# EAGLE design AutoTunerV1 (EAGLE 9.6.2)

## Sheet 1 of 4: mcu
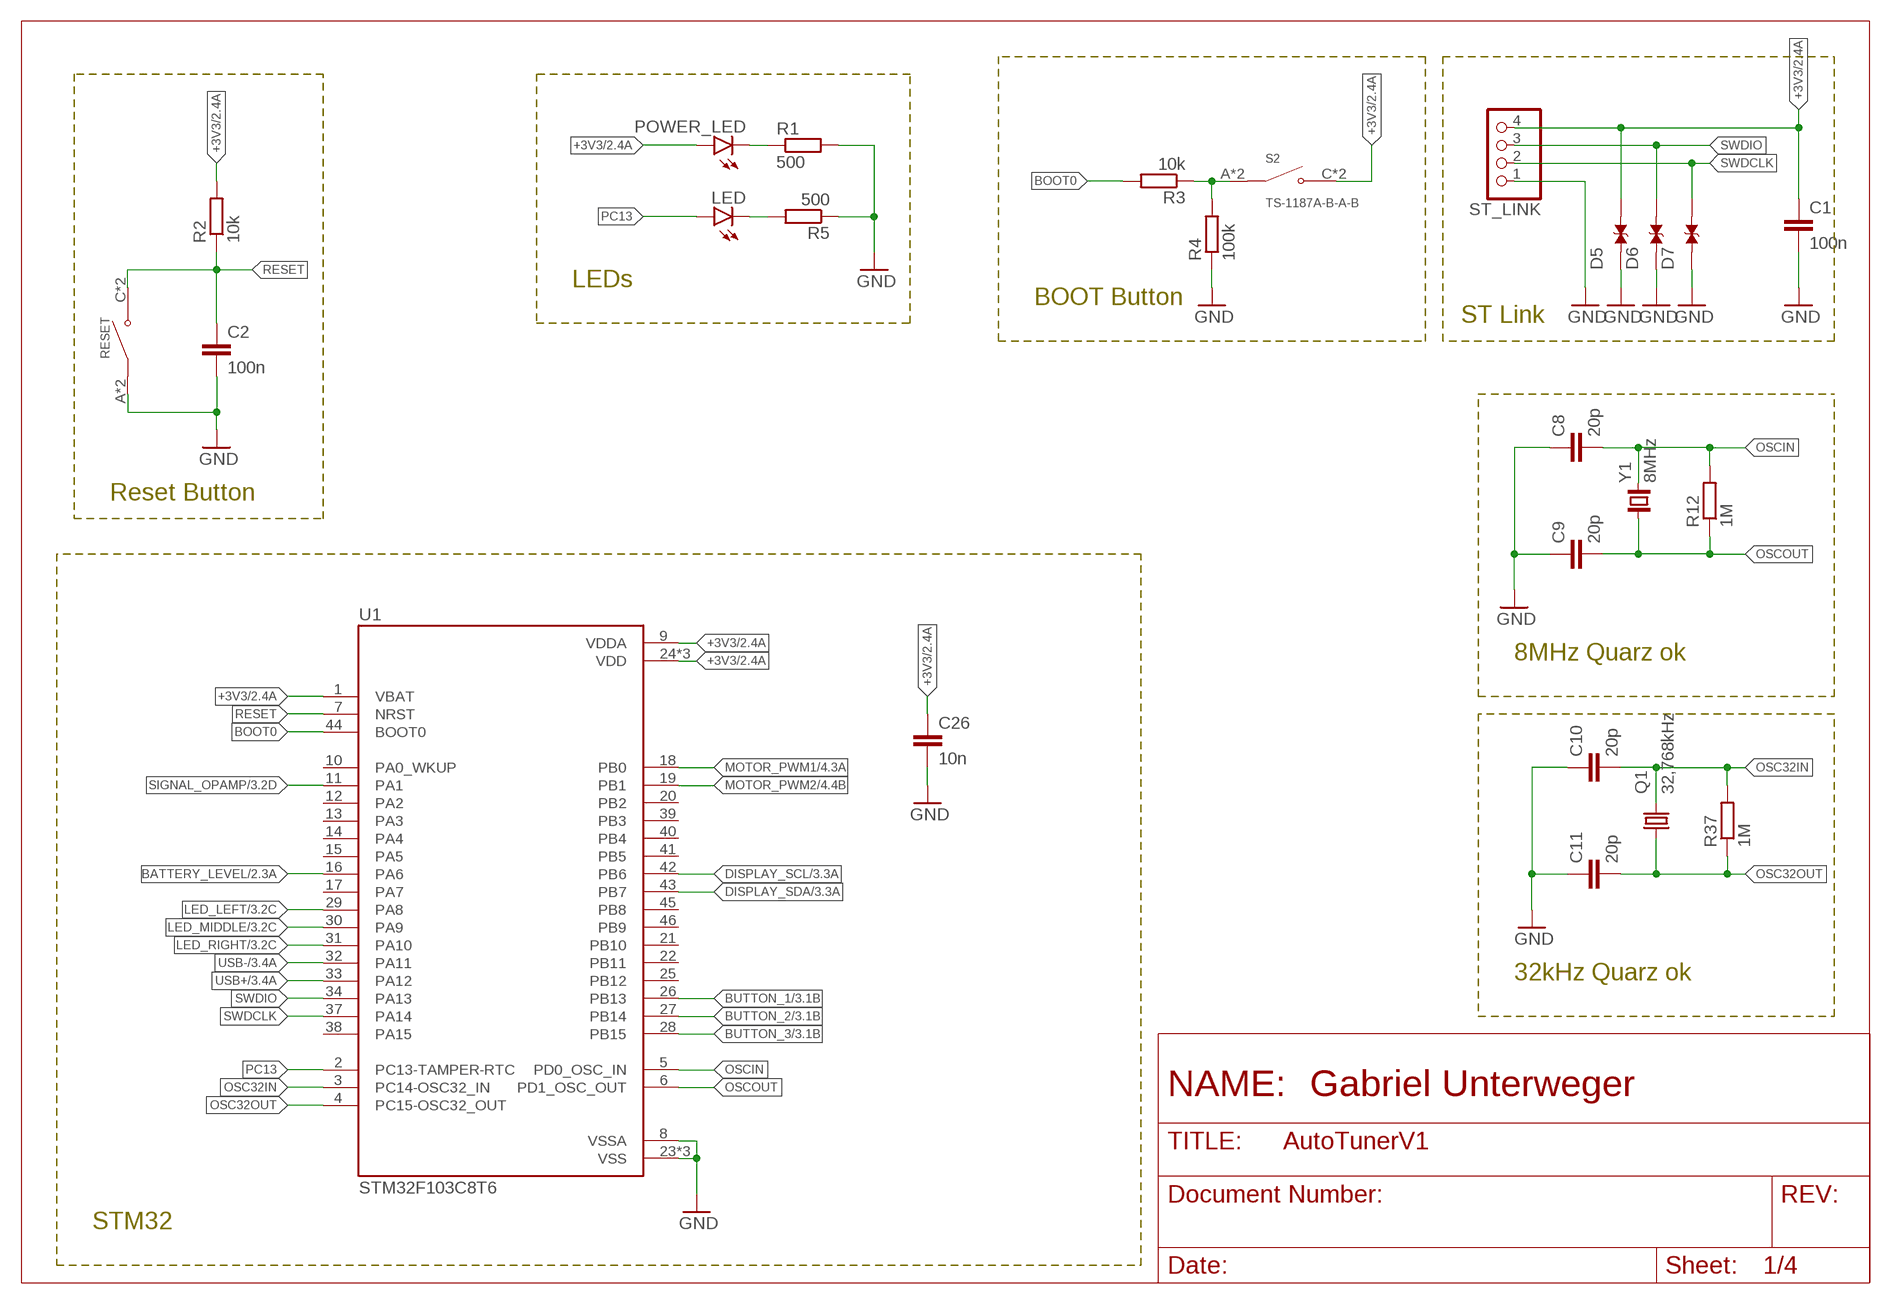
[diagram p0: schematic, sheet 1]

### Parts
C1  100n  C-EUC0805  [C0805]
C2  100n  C-EUC0805  [C0805]
C8  20p  C-EUC0805  [C0805]
C9  20p  C-EUC0805  [C0805]
C10  20p  C-EUC0805  [C0805]
C11  20p  C-EUC0805  [C0805]
C26  10n  C-EUC0805  [C0805]
D5  TESD5V0L1UC_RJG  [DIO_TESD5V0L1UC_RJG]
D6  TESD5V0L1UC_RJG  [DIO_TESD5V0L1UC_RJG]
D7  TESD5V0L1UC_RJG  [DIO_TESD5V0L1UC_RJG]
LED  LEDCHIPLED_0805  [CHIPLED_0805]
POWER_LED  LEDCHIPLED_0805  [CHIPLED_0805]
Q1  32,768kHz  KX-327-NHF  [3.2X1.5]
R1  500  R-EU_R0805  [R0805]
R2  10k  R-EU_R0805  [R0805]
R3  10k  R-EU_R0805  [R0805]
R4  100k  R-EU_R0805  [R0805]
R5  500  R-EU_R0805  [R0805]
R12  1M  R-EU_R0805  [R0805]
R37  1M  R-EU_R0805  [R0805]
RESET  TS-1187A-B-A-B  [SW_TS-1187A-B-A-B]
S2  TS-1187A-B-A-B  [SW_TS-1187A-B-A-B]
ST_LINK  PINHD-1X4  [1X04]
U1  STM32F103C8T6  [QFP50P900X900X160-48N]
Y1  8MHz  CRYSTAL_NX5032GA  [CRYSTAL_2-SMD-5X3]

### Nets
+3V3: C1.1 C26.1 D5.2 POWER_LED.A R2.2 S2.C(NO) S2.D(NO) ST_LINK.4 U1.1(VBAT) U1.9(VDDA) U1.24(VDD) U1.36(VDD) U1.48(VDD) ; also sheet 2,3,4
BATTERY_LEVEL: U1.16(PA6) ; also sheet 2
BOOT0: R3.2 U1.44(BOOT0)
BUTTON_1: U1.26(PB13) ; also sheet 3
BUTTON_2: U1.27(PB14) ; also sheet 3
BUTTON_3: U1.28(PB15) ; also sheet 3
DISPLAY_SCL: U1.42(PB6) ; also sheet 3
DISPLAY_SDA: U1.43(PB7) ; also sheet 3
GND: C1.2 C2.2 C8.1 C9.1 C10.1 C11.1 C26.2 D5.1 D6.1 D7.1 R1.2 R4.1 R5.1 RESET.A(COM) RESET.B(COM) ST_LINK.1 U1.8(VSSA) U1.23(VSS) U1.35(VSS) U1.47(VSS) ; also sheet 2,3,4
LED_LEFT: U1.29(PA8) ; also sheet 3
LED_MIDDLE: U1.30(PA9) ; also sheet 3
LED_RIGHT: U1.31(PA10) ; also sheet 3
MOTOR_PWM1: U1.18(PB0) ; also sheet 4
MOTOR_PWM2: U1.19(PB1) ; also sheet 4
N$2: LED.C R5.2
N$3: POWER_LED.C R1.1
N$5: R3.1 R4.2 S2.A(COM) S2.B(COM)
OSC32IN: C10.2 Q1.2 R37.2 U1.3(PC14-OSC32_IN)
OSC32OUT: C11.2 Q1.1 R37.1 U1.4(PC15-OSC32_OUT)
OSCIN: C8.2 R12.2 U1.5(PD0_OSC_IN) Y1.2
OSCOUT: C9.2 R12.1 U1.6(PD1_OSC_OUT) Y1.1
PC13: LED.A U1.2(PC13-TAMPER-RTC)
RESET: C2.1 R2.1 RESET.C(NO) RESET.D(NO) U1.7(NRST)
SIGNAL_OPAMP: U1.11(PA1) ; also sheet 3,4
SWDCLK: D7.2 ST_LINK.2 U1.37(PA14)
SWDIO: D6.2 ST_LINK.3 U1.34(PA13)
USB+: U1.33(PA12) ; also sheet 3
USB-: U1.32(PA11) ; also sheet 3
Unconnected: U1.10(PA0_WKUP) U1.12(PA2) U1.13(PA3) U1.14(PA4) U1.15(PA5) U1.17(PA7) U1.20(PB2) U1.21(PB10) U1.22(PB11) U1.25(PB12) U1.38(PA15) U1.39(PB3) U1.40(PB4) U1.41(PB5) U1.45(PB8) U1.46(PB9)

### Notes on the sheet
- LEDs
- BOOT Button
- ST Link
- Reset Button
- 8MHz Quarz ok
- 32kHz Quarz ok
- STM32

## Sheet 2 of 4: battery / voltage converter
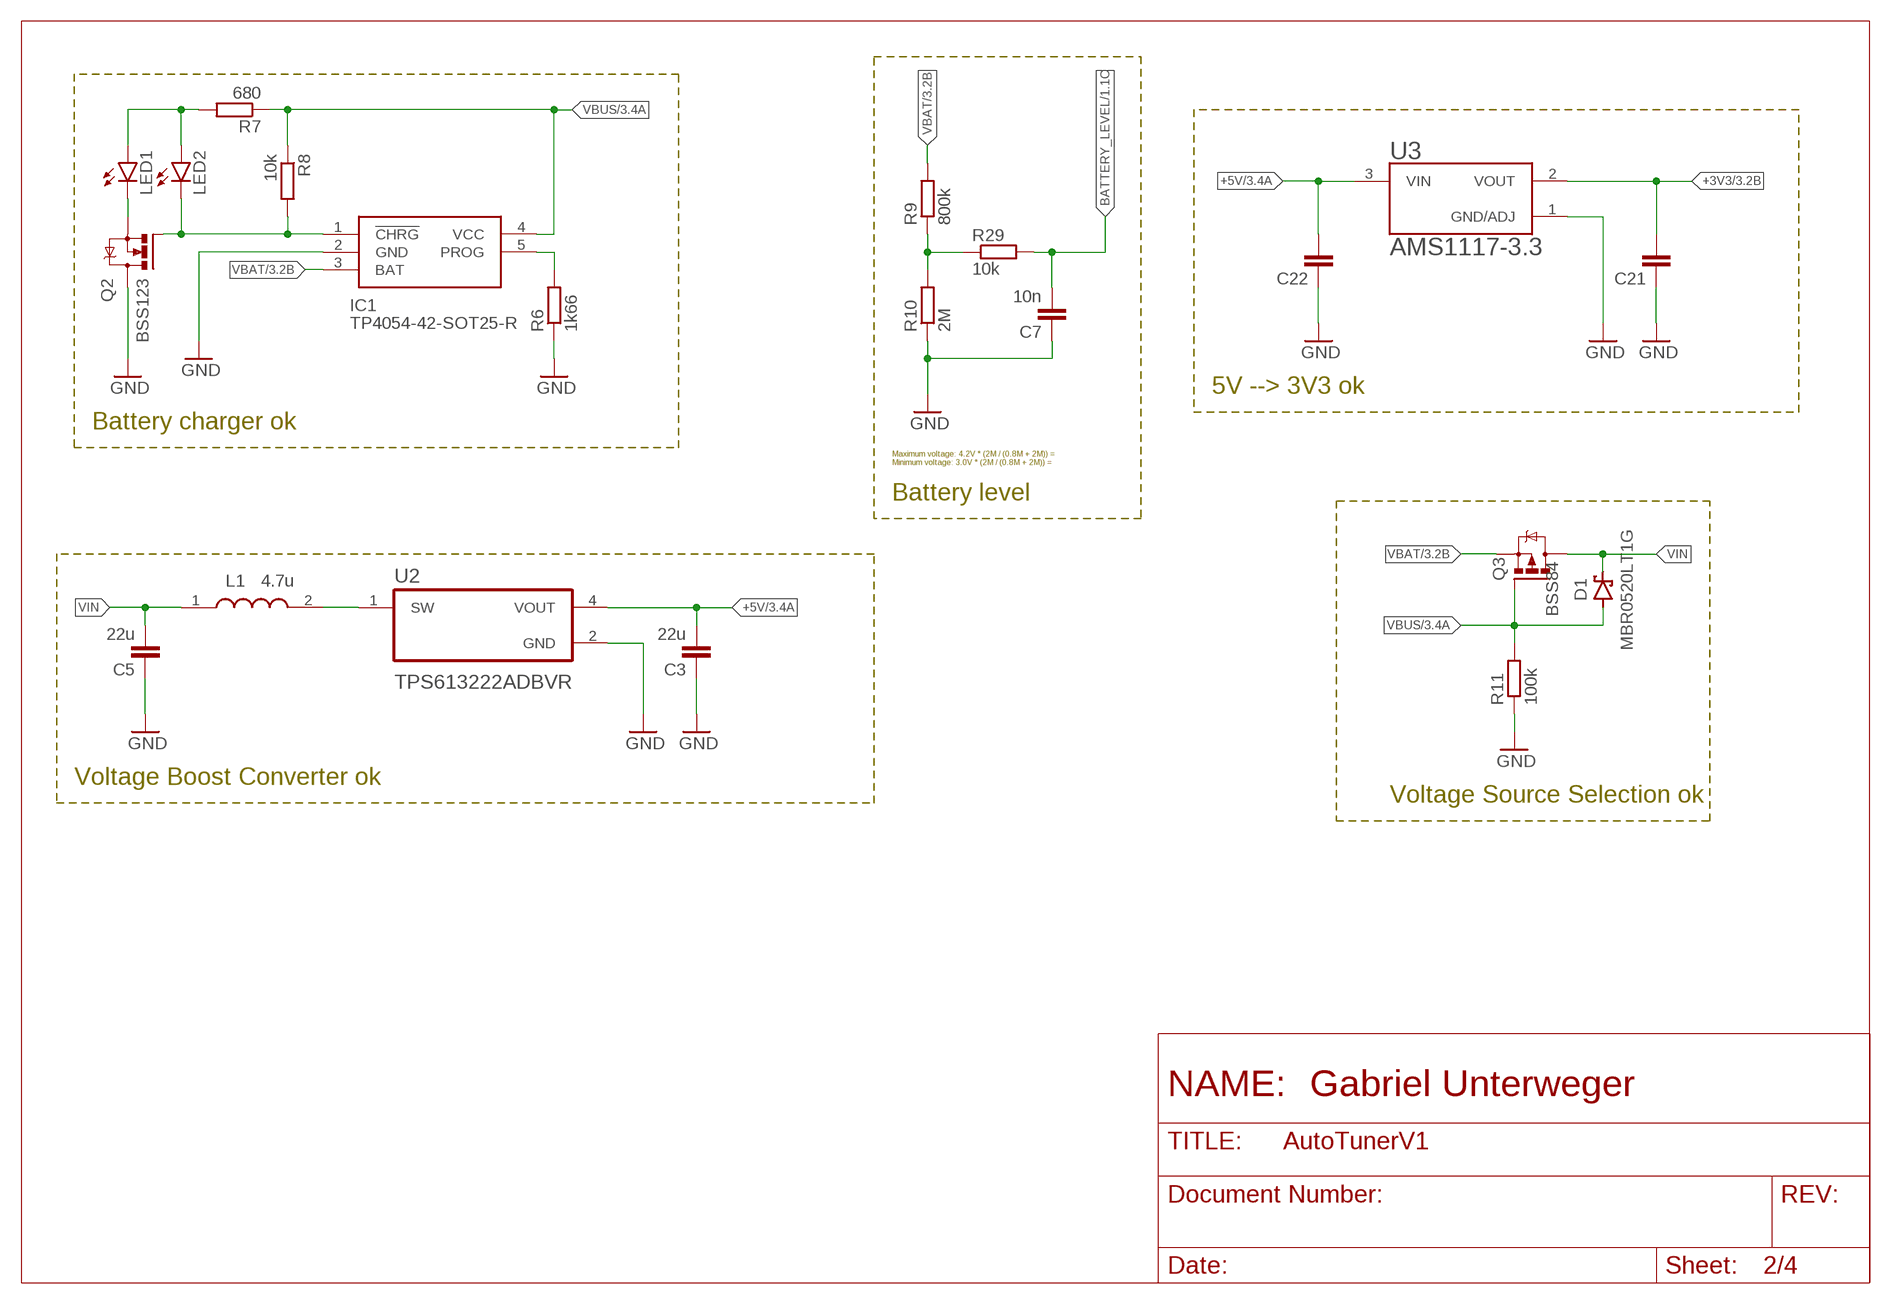
[diagram p1: schematic, sheet 2]

### Parts
C3  22u  C-EUC0805  [C0805]
C5  22u  C-EUC0805  [C0805]
C7  10n  C-EUC0805  [C0805]
C21  C-EUC0805  [C0805]
C22  C-EUC0805  [C0805]
D1  MBR0520LT1G  SCHOTTKY_MBR0520LT1GDO-219  [SODFL3718X115]
IC1  TP4054-42-SOT25-R  [SOT95P280X100-5N]
L1  4.7u  DFE252012P-4R7M=P2  [DFE2HCAH1R0MJ0L]
LED1  LEDCHIPLED_0805  [CHIPLED_0805]
LED2  LEDCHIPLED_0805  [CHIPLED_0805]
Q2  BSS123  NMOSFET_BSS123_SOT23-GSD  [SOT23]
Q3  BSS84  PMOSFET_BSS84_SOT23-GSD  [SOT23]
R6  1k66  R-EU_R0805  [R0805]
R7  680  R-EU_R0805  [R0805]
R8  10k  R-EU_R0805  [R0805]
R9  800k  R-EU_R0805  [R0805]
R10  2M  R-EU_R0805  [R0805]
R11  100k  R-EU_R0805  [R0805]
R29  10k  R-EU_R0805  [R0805]
U2  TPS613222ADBVR  [SOT95P280X145-5N]
U3  AMS1117-3.3  [SOT229P700X180-4N]

### Nets
+3V3: C21.2 U3.2(VOUT) ; also sheet 1,3,4
+5V: C3.2 C22.2 U2.4(VOUT) U3.3(VIN) ; also sheet 3
BATTERY_LEVEL: C7.2 R29.2 ; also sheet 1
GND: C3.1 C5.1 C7.1 C21.1 C22.1 IC1.2(GND) Q2.3(D) R6.1 R10.1 R11.1 U2.2(GND) U3.1(GND/ADJ) ; also sheet 1,3,4
N$1: L1.2 U2.1(SW)
N$4: R9.1 R10.2 R29.1
N$8: IC1.5(PROG) R6.2
N$9: IC1.1(!CHRG) LED2.C Q2.1(G) R8.2
N$11: LED1.A LED2.A R7.2
N$12: LED1.C Q2.2(S)
VBAT: IC1.3(BAT) Q3.2(S) R9.2 ; also sheet 3,4
VBUS: D1.2(A) IC1.4(VCC) Q3.1(G) R7.1 R8.1 R11.2 ; also sheet 3
VIN: C5.2 D1.1(C) L1.1 Q3.3(D)

### Notes on the sheet
- 5V --> 3V3 ok
- Battery charger ok
- Maximum voltage: 4.2V * (2M / (0.8M + 2M)) =
  Minimum voltage: 3.0V * (2M / (0.8M + 2M)) =
- Battery level
- Voltage Boost Converter ok
- Voltage Source Selection ok

## Sheet 3 of 4: I/O
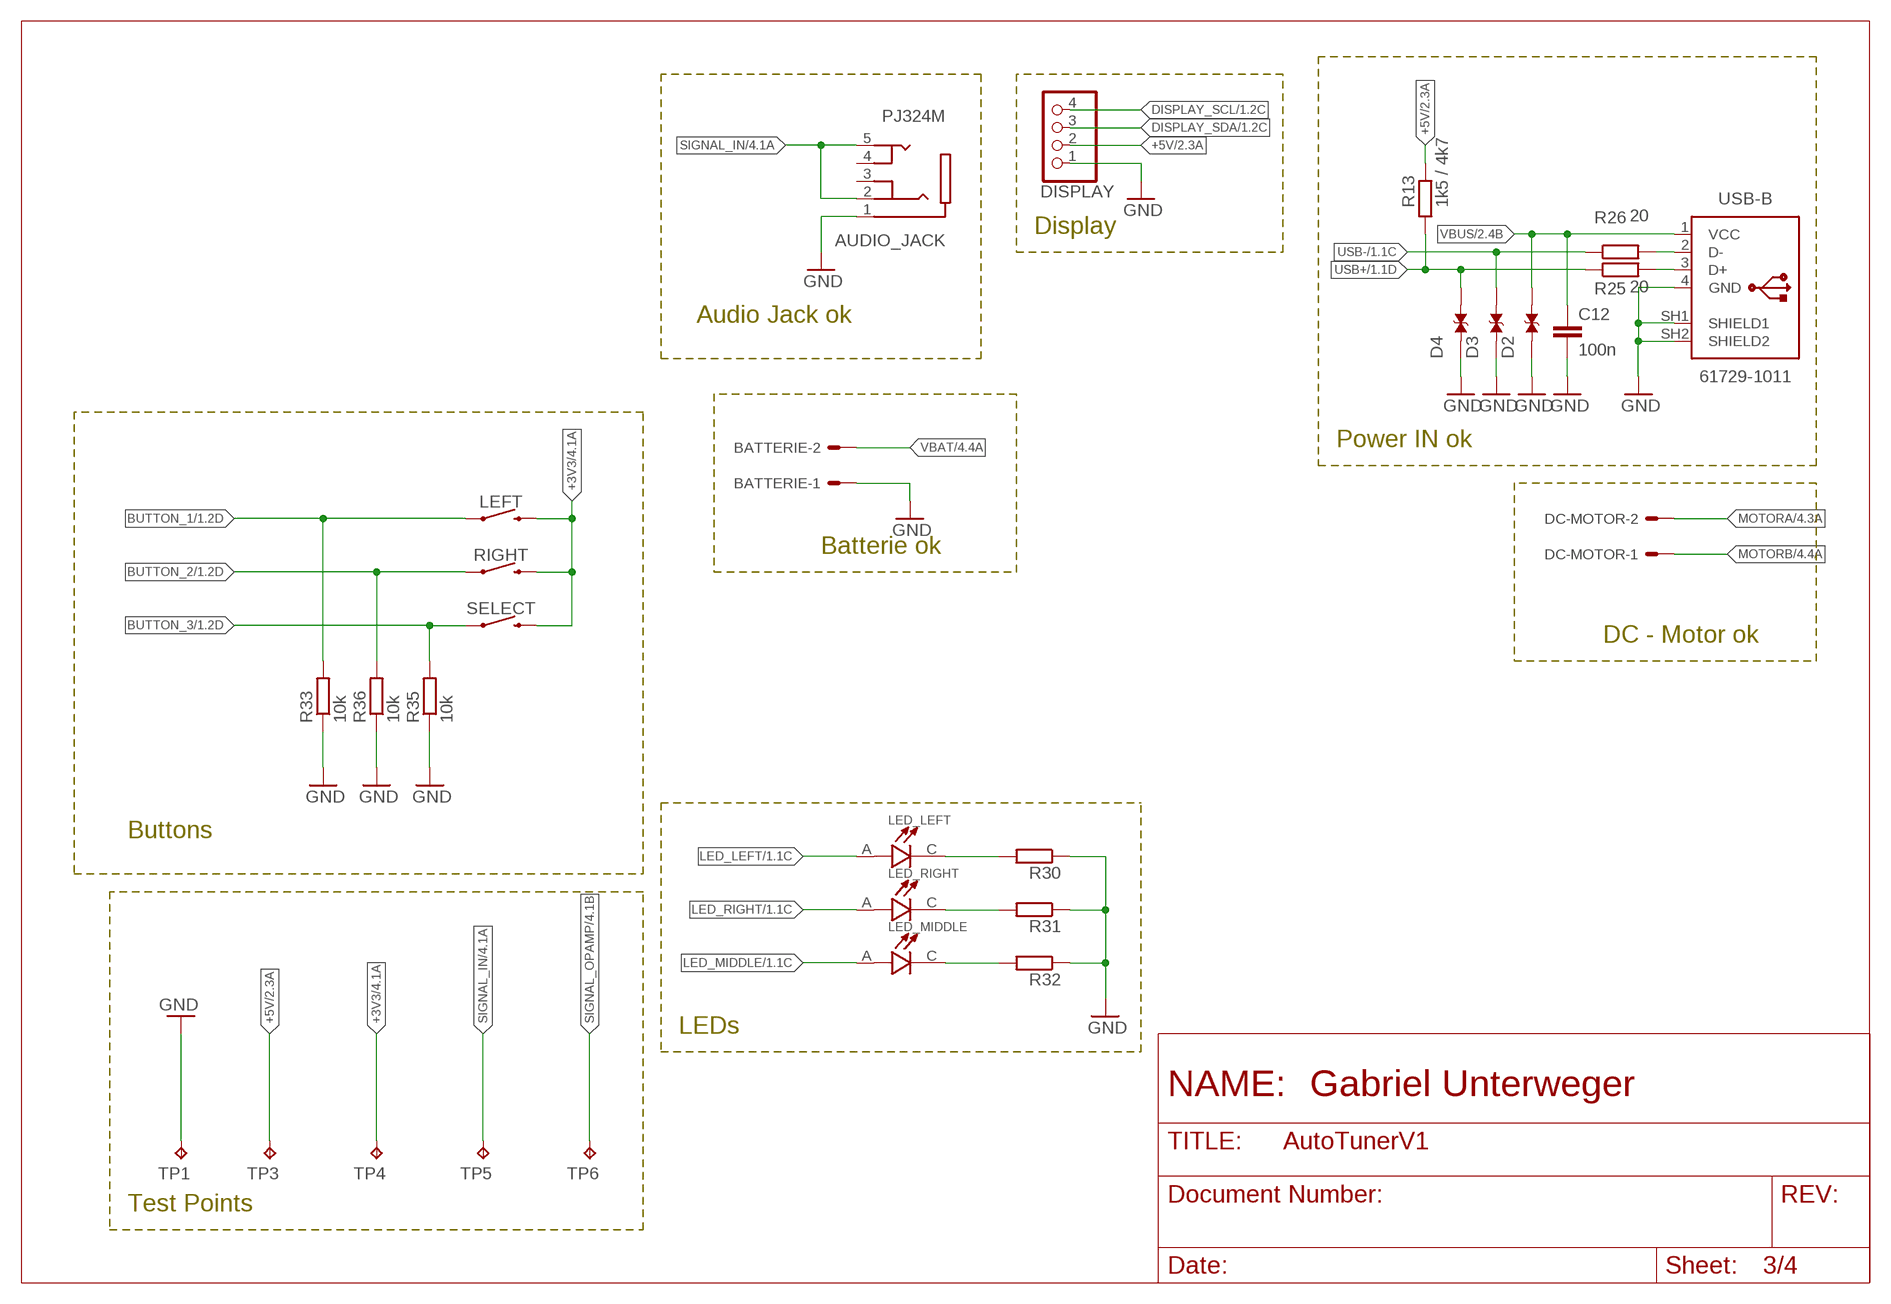
[diagram p2: schematic, sheet 3]

### Parts
AUDIO_JACK  PJ324M  [WENZHOU_PJ324M]
BATTERIE  22-27-2021-02  [6410-02]
C12  100n  C-EUC0805  [C0805]
D2  TESD5V0L1UC_RJG  [DIO_TESD5V0L1UC_RJG]
D3  TESD5V0L1UC_RJG  [DIO_TESD5V0L1UC_RJG]
D4  TESD5V0L1UC_RJG  [DIO_TESD5V0L1UC_RJG]
DC-MOTOR  22-27-2021-02  [6410-02]
DISPLAY  PINHD-1X4  [1X04]
LED_LEFT  L-53GD  [LEDRD254W50D500H1060]
LED_MIDDLE  L-53GD  [LEDRD254W50D500H1060]
LED_RIGHT  L-53GD  [LEDRD254W50D500H1060]
LEFT  MOMENTARY-SWITCH-SPST-PTH-12MM  [TACTILE_SWITCH_PTH_12MM]
R13  1k5 / 4k7  R-EU_R0805  [R0805]
R25  20  R-EU_R0805  [R0805]
R26  20  R-EU_R0805  [R0805]
R30  R-EU_R0805  [R0805]
R31  R-EU_R0805  [R0805]
R32  R-EU_R0805  [R0805]
R33  10k  R-EU_R0805  [R0805]
R35  10k  R-EU_R0805  [R0805]
R36  10k  R-EU_R0805  [R0805]
RIGHT  MOMENTARY-SWITCH-SPST-PTH-12MM  [TACTILE_SWITCH_PTH_12MM]
SELECT  MOMENTARY-SWITCH-SPST-PTH-12MM  [TACTILE_SWITCH_PTH_12MM]
TP1  TPB1,27  [B1,27]
TP3  TPB1,27  [B1,27]
TP4  TPB1,27  [B1,27]
TP5  TPB1,27  [B1,27]
TP6  TPB1,27  [B1,27]
USB-B  61729-1011  [61729-1011BLF]

### Nets
+3V3: LEFT.3 RIGHT.3 SELECT.3 TP4.TP ; also sheet 1,2,4
+5V: DISPLAY.2 R13.2 TP3.TP ; also sheet 2
BUTTON_1: LEFT.1 R33.2 ; also sheet 1
BUTTON_2: R36.2 RIGHT.1 ; also sheet 1
BUTTON_3: R35.2 SELECT.1 ; also sheet 1
DISPLAY_SCL: DISPLAY.4 ; also sheet 1
DISPLAY_SDA: DISPLAY.3 ; also sheet 1
GND: AUDIO_JACK.1(SLEEVE) BATTERIE.1 C12.2 D2.1 D3.1 D4.1 DISPLAY.1 R30.1 R31.1 R32.1 R33.1 R35.1 R36.1 TP1.TP USB-B.4(GND) USB-B.SH1(SHIELD1) USB-B.SH2(SHIELD2) ; also sheet 1,2,4
LED_LEFT: LED_LEFT.A ; also sheet 1
LED_MIDDLE: LED_MIDDLE.A ; also sheet 1
LED_RIGHT: LED_RIGHT.A ; also sheet 1
MOTORA: DC-MOTOR.2 ; also sheet 4
MOTORB: DC-MOTOR.1 ; also sheet 4
N$19: LED_LEFT.C R30.2
N$20: LED_RIGHT.C R31.2
N$23: LED_MIDDLE.C R32.2
N$29: R25.2 USB-B.3(D+)
N$30: R26.2 USB-B.2(D-)
SIGNAL_IN: AUDIO_JACK.2(RING_1) AUDIO_JACK.5(TIP_2) TP5.TP ; also sheet 4
SIGNAL_OPAMP: TP6.TP ; also sheet 1,4
USB+: D4.2 R13.1 R25.1 ; also sheet 1
USB-: D3.2 R26.1 ; also sheet 1
VBAT: BATTERIE.2 ; also sheet 2,4
VBUS: C12.1 D2.2 USB-B.1(VCC) ; also sheet 2
Unconnected: AUDIO_JACK.3(RING_2) AUDIO_JACK.4(TIP_1)

### Notes on the sheet
- Display
- Audio Jack ok
- Power IN ok
- Batterie ok
- DC - Motor ok
- Buttons
- LEDs
- Test Points

## Sheet 4 of 4: Motor Steuerung / Signal Verarbeitung
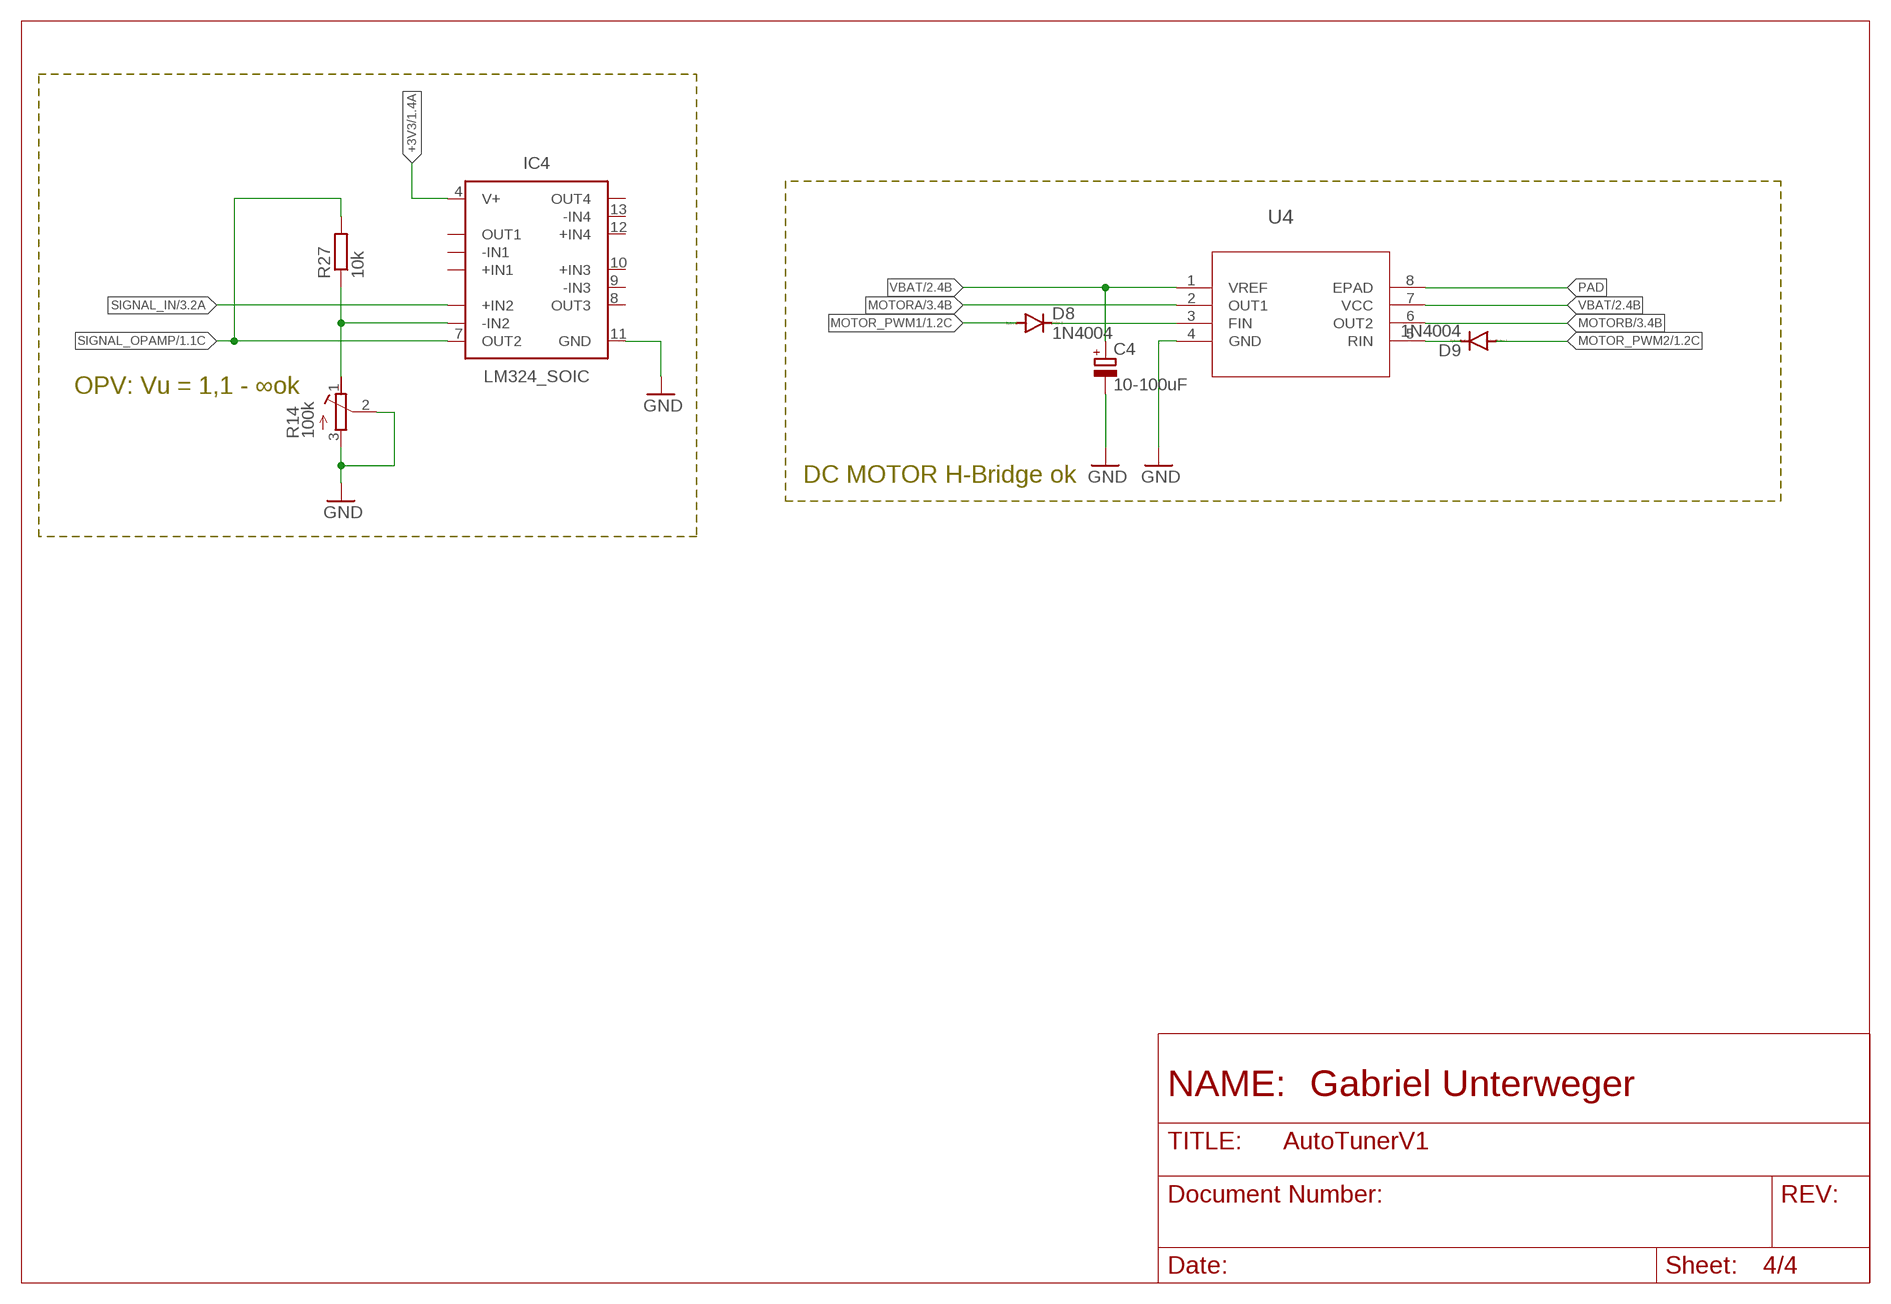
[diagram p3: schematic, sheet 4]

### Parts
C4  10-100uF  CPOL-EUB45181A  [B45181A]
D8  1N4004  [DO41-10]
D9  1N4004  [DO41-10]
IC4  LM324_SOIC  [SOIC127P600X175-14N]
R14  100k  R-TRIMM43P  [RTRIM43P]
R27  10k  R-EU_R0805  [R0805]
U4  BD6222HFP-TRHRP7_ROM-M  [HRP7_ROM-M]

### Nets
+3V3: IC4.4(V+) ; also sheet 1,2,3
GND: C4.- IC4.11(GND) R14.2(S) R14.3(A) U4.4(GND) ; also sheet 1,2,3
MOTOR_PWM1: D8.A ; also sheet 1
MOTOR_PWM2: D9.A ; also sheet 1
MOTORA: U4.2(OUT1) ; also sheet 3
MOTORB: U4.6(OUT2) ; also sheet 3
N$6: D8.C U4.3(FIN)
N$7: U4.7(VCC)
N$14: D9.C U4.5(RIN)
N$16: IC4.6(-IN2) R14.1(E) R27.1
PAD: U4.8(EPAD)
SIGNAL_IN: IC4.5(+IN2) ; also sheet 3
SIGNAL_OPAMP: IC4.7(OUT2) R27.2 ; also sheet 1,3
VBAT: C4.+ U4.1(VREF) ; also sheet 2,3
Unconnected: IC4.1(OUT1) IC4.2(-IN1) IC4.3(+IN1) IC4.8(OUT3) IC4.9(-IN3) IC4.10(+IN3) IC4.12(+IN4) IC4.13(-IN4) IC4.14(OUT4)

### Notes on the sheet
- OPV: Vu = 1,1 - ∞ok
- DC MOTOR H-Bridge ok

## Library data of the parts
AUDIO_JACK = PJ324M:PJ324M: Headphone Stereo jack/Audio connector Check availability <https://pricing.snapeda.com/parts/PJ324M/Wenzhou%20QingPu%20Electronics%20Co.Ltd/view-part?ref=eda>; AVAILABILITY: Not in stock; CHECK_PRICES: https://www.snapeda.com/parts/PJ324M/Wenzhou+QingPu+Electronics+Co.Ltd/view-part/?ref=eda; DESCRIPTION: Headphone Stereo jack/Audio connector; MF: Wenzhou QingPu Electronics Co.Ltd; MP: PJ324M; PACKAGE: Package; PRICE: None; SNAPEDA_LINK: https://www.snapeda.com/parts/PJ324M/Wenzhou+QingPu+Electronics+Co.Ltd/view-part/?ref=snap
BATTERIE DC-MOTOR = con-molex:22-?-02: CONNECTOR wire to board 2.54 mm (.1 inch) pitch header; MF: MOLEX; OC_FARNELL: unknown; OC_NEWARK: unknown
C1-C3 C5 C7-C12 C21 C22 C26 = rcl:C-EU: CAPACITOR, European symbol; SPICEPREFIX: C
C4 = rcl:CPOL-EU: POLARIZED CAPACITOR, European symbol; SPICEPREFIX: C
D1 = Diode:SCHOTTKY_: Schottky Diode - Popular parts; CATEGORY: Diode; DESCRIPTION: DIODE SCHOTTKY 20V 500MA SOD123; LCSC_PART: C191023; MANUFACTURER: ON Semiconductor; MPN: MBR0520LT1G; SUB-CATEGORY: Schottky
D2-D7 = TESD5V0L1UC_RJG:TESD5V0L1UC_RJG: Check availability <https://pricing.snapeda.com/parts/TESD5V0L1UC%20RJG/Taiwan%20Semiconductor%20Corporation/view-part?ref=eda>; AVAILABILITY: In Stock; CHECK_PRICES: https://www.snapeda.com/parts/TESD5V0L1UC%20RJG/Taiwan+Semiconductor/view-part/?ref=eda; DESCRIPTION: DFN1006L, 5V, 100W, 2pF, ESD Protection Diode & Array; LCSC_PART: C7420372; MF: Taiwan Semiconductor Corporation; MP: TESD5V0L1UC RJG; PACKAGE: DFN1006L Taiwan Semiconductor; PRICE: None; PURCHASE-URL: https://www.snapeda.com/api/url_track_click_mouser/?unipart_id=3789592&manufacturer=Taiwan Semiconductor Corporation&part_name=TESD5V0L1UC RJG&search_term=protection diode; SNAPEDA_LINK: https://www.snapeda.com/parts/TESD5V0L1UC%20RJG/Taiwan+Semiconductor/view-part/?ref=snap
D8 D9 = diode:1N4004: DIODE general purpose rectifier, 1 A
DISPLAY ST_LINK = pinhead:PINHD-1X4: PIN HEADER
IC1 = TP4054-42-SOT25-R:TP4054-42-SOT25-R: Standalone Linear Li-ion Battery Charger with Thermal Regulation, SOT-23-5 Source: Datasheet <http://images.100y.com.tw/pdf_file/38-TP-TP4054x.pdf>; DESCRIPTION: Standalone Linear Li-ion Battery Charger with Thermal Regulation, SOT-23-5; HEIGHT: 1mm; LCSC_PART: C32574; MANUFACTURER_NAME: TOP POWER; MANUFACTURER_PART_NUMBER: TP4054-42-SOT25-R
IC4 = IC_Linear:LM324: Quad-Operational Amplifiers Reference Datasheet <https://www.ti.com/lit/ds/snosc16d/snosc16d.pdf>; CATEGORY: Operational Amplifiers; DESCRIPTION: Quad-Operational Amplifiers; LCSC_PART: C71035; MANUFACTURER: Generic; MPN: Generic; SERIES: LM324; SUB-CATEGORY: Amplifier ICs; TYPE: Op Amps - Operational Amplifiers
L1 = DFE252012P-4R7M=P2:DFE252012P-4R7M=P2: Toko DFE252012P Series Shielded Wire-wound SMD Inductor with a Powered Iron Core, 4.7 uH Wire-Wound 2.2A Idc Source: Datasheet <https://psearch.en.murata.com/inductor/product/DFE252012P-4R7M#.html>; ARROW_PART_NUMBER: DFE252012P-4R7M=P2; ARROW_PRICE-STOCK: https://www.arrow.com/en/products/dfe252012p-4r7mp2/murata-manufacturing?region=europe; DESCRIPTION: Toko DFE252012P Series Shielded Wire-wound SMD Inductor with a Powered Iron Core, 4.7 uH Wire-Wound 2.2A Idc; HEIGHT: 1.2mm; LCSC_PART: C391306; MANUFACTURER_NAME: Murata Electronics; MANUFACTURER_PART_NUMBER: DFE252012P-4R7M=P2; MOUSER_PART_NUMBER: 81-DFE252012P-4R7MP2; MOUSER_PRICE-STOCK: https://www.mouser.co.uk/ProductDetail/Murata-Electronics/DFE252012P-4R7M%3dP2?qs=KuGPmAKtFKVp8Hnp6vDIBg%3D%3D
LED LED1 LED2 POWER_LED = led:LED: LED OSRAM: - CHIPLED LG R971, LG N971, LY N971, LG Q971, LY Q971, LO R971, LY R971 LH N974, LH R974 LS Q976, LO Q976, LY Q976 LO Q996 - Hyper CHIPLED LW Q18S LB Q993, LB Q99A, LB R99A - SideLED LS A670, LO A670, LY A670, LG A670, LP A670 LB A673, LV A673, LT A673, LW A673 LH A674 LY A675 LS A676, LA A676, LO A676, LY A676, LW A676 LS A679, LY A679, LG A679 - Hyper Micro SIDELED® LS Y876, LA Y876, LO Y876, LY Y876 LT Y87S - SmartLED LW L88C, LW L88S LB L89C, LB L89S, LG L890 LS L89K, LO L89K, LY L89K LS L896, LA L896, LO L896, LY L896 - TOPLED LS T670, LO T670, LY T670, LG T670, LP T670 LSG T670, LSP T670, LSY T670, LOP T670, LYG T670 LG T671, LOG T671, LSG T671 LB T673, LV T673, LT T673, LW T673 LH T674 LS T676, LA T676, LO T676, LY T676, LB T676, LH T676, LSB T676, LW T676 LB T67C, LV T67C, LT T67C, LS T67K, LO T67K, LY T67K, LW E67C LS E67B, LA E67B, LO E67B, LY E67B, LB E67C, LV E67C, LT E67C LW T67C LS T679, LY T679, LG T679 LS T770, LO T770, LY T770, LG T770, LP T770 LB T773, LV T773, LT T773, LW T773 LH T774 LS E675, LA E675, LY E675, LS T675 LS T776, LA T776, LO T776, LY T776, LB T776 LHGB T686 LT T68C, LB T68C - Hyper Mini TOPLED® LB M676 - Mini TOPLED Santana® LG M470 LS M47K, LO M47K, LY M47K Source: http://www.osram.convergy.de LUXEON: - LUMILED® LXK2-PW12-R00, LXK2-PW12-S00, LXK2-PW14-U00, LXK2-PW14-V00 LXK2-PM12-R00, LXK2-PM12-S00, LXK2-PM14-U00 LXK2-PE12-Q00, LXK2-PE12-R00, LXK2-PE12-S00, LXK2-PE14-T00, LXK2-PE14-U00 LXK2-PB12-K00, LXK2-PB12-L00, LXK2-PB12-M00, LXK2-PB14-N00, LXK2-PB14-P00, LXK2-PB14-Q00 LXK2-PR12-L00, LXK2-PR12-M00, LXK2-PR14-Q00, LXK2-PR14-R00 LXK2-PD12-Q00, LXK2-PD12-R00, LXK2-PD12-S00 LXK2-PH12-R00, LXK2-PH12-S00 LXK2-PL12-P00, LXK2-PL12-Q00, LXK2-PL12-R00 Source: www.luxeon.com KINGBRIGHT: KA-3528ASYC Source: www.kingbright.com
LED_LEFT LED_MIDDLE LED_RIGHT = L-53GD:L-53GD: LED; 5mm; green; 5-32mcd; 60°; Front: convex Check availability <https://pricing.snapeda.com/parts/L-53GD/Kingbright/view-part?ref=eda>; AVAILABILITY: In Stock; CHECK_PRICES: https://www.snapeda.com/parts/L-53GD/Kingbright/view-part/?ref=eda; DESCRIPTION: LED; 5mm; green; 5-32mcd; 60°; Front: convex; MF: Kingbright; MP: L-53GD; PACKAGE: CDIP-28 Kingbright; PRICE: None; PURCHASE-URL: https://www.snapeda.com/api/url_track_click_mouser/?unipart_id=525636&manufacturer=Kingbright&part_name=L-53GD&search_term=led, 5mm; SNAPEDA_LINK: https://www.snapeda.com/parts/L-53GD/Kingbright/view-part/?ref=snap
LEFT RIGHT SELECT = SparkFun-Switches:MOMENTARY-SWITCH-SPST: Momentary Switch (Pushbutton) - SPST Normally-open (NO) SPST momentary switches (buttons, pushbuttons). Variants PTH-12MM - 12mm square, through-hole Momentary Pushbutton Switch - 12mm Square <https://www.sparkfun.com/products/9190> (COM-09190) PTH-6.0MM, PTH-6.0MM-KIT - 6.0mm square, through-hole Mini Pushbutton Switch <https://www.sparkfun.com/products/97> (COM-00097) KIT package intended for soldering kit's - only one side of pads' copper is exposed. PTH-RIGHT-ANGLE-KIT - Right-angle, through-hole Right Angle Tactile Button <https://www.sparkfun.com/products/10791> - Used on SparkFun BigTime Watch Kit <https://www.sparkfun.com/products/11734> SMD-12MM - 12mm square, surface-mount Tactile Button - SMD (12mm) <https://www.sparkfun.com/products/12993> (COM-12993) Used on SparkFun PicoBoard <https://www.sparkfun.com/products/11888> SMD-4.5MM - 4.5mm Square Trackball Switch Used on SparkFun Blackberry Trackballer Breakout <https://www.sparkfun.com/products/13169> SMD-4.6MMX2.8MM - 4.60mm x 2.80mm, surface mount Used on SparkFun Pro Micro - RP2040 <https://www.sparkfun.com/products/17717> SMD-5.2MM, SMD-5.2-REDUNDANT - 5.2mm square, surface-mount Mini Pushbutton Switch - SMD <https://www.sparkfun.com/products/8720> (COM-08720) Used on Arduino Pro Mini <https://www.sparkfun.com/products/11114> REDUNDANT package connects both switch circuits together SMD-6.0X3.5MM - 6.0 x 3.5mm, surface mount Momentary Reset Switch SMD <https://www.sparkfun.com/products/8229> (COM-08229) SMD-6.2MM-TALL - 6.2mm square, surface mount Tactile Button - SMD (6mm) <https://www.sparkfun.com/products/12992> Used on SparkFun Digital Sandbox <https://www.sparkfun.com/products/12651> SMD-RIGHT-ANGLE - Right-angle, surface mount Used on SparkFun Block for Intel® Edison - Arduino <https://www.sparkfun.com/products/13036>; PROD_ID: SWCH-09185; SF_SKU: COM-09190
Q1 = crystal-geyer_V1_0:KX-327: Tuning Fork Crystals (kHz) SMD: KX327 - Serie Model Size l/w/h [mm] Frequency Range Frequency Stability Temp. Range [°C] Load Capacitance AECQ 200 availabel Datasheet KX-327VT KX-327FT KX-327RT KX-327NHT KX-327NHF KX-327L KX-327S 1.25/1.05/0.5 1.6/1.0/0.5 2.0/1.2/0.6 3.2/1.5/0.8 3.2/1.5/0.8 7.0/1.5/1.4 8.2/3.8/2.5 32,768 kHz 32,768 kHz 32,768 kHz 32,768 kHz 32,768 kHz 32,768 kHz 32,768 kHz ±10 … ±20ppm ±10 … ±20ppm ±10 … ±20ppm ±10 … ±20ppm ±10 … ±20ppm ±10 … ±20ppm ±5 … ±20ppm (*) -40°C …+85°C (*) -40°C …+85°C (*) -40°C …+85°C (*) -40°C …+85°C (*) -40°C …+125°C (*) -40°C …+85°C (*) -40°C …+85°C 7/9/12,5 7/9/12,5 7/9/12,6 7/9/12,5 9/12,5 7/9/12,5 6/12,5 - - - - yes - - KX-327VT.pdf <http://www.geyer-electronic.de/uploads/tx_userartikelfrequenz/GEYER-KX-327VT.pdf> KX-327FT.pdf <http://www.geyer-electronic.de/uploads/tx_userartikelfrequenz/GEYER-KX-327FT.pdf> KX-327RT.pdf <http://www.geyer-electronic.de/uploads/tx_userartikelfrequenz/GEYER-KX-327RT.pdf> KX-327NHT.pdf <http://www.geyer-electronic.de/uploads/tx_userartikelfrequenz/GEYER-KX-327NHT.pdf> KX-327NHF.pdf <http://www.geyer-electronic.de/uploads/tx_userartikelfrequenz/GEYER-KX-327NHF.pdf> KX-327L.pdf <http://www.geyer-electronic.de/uploads/tx_userartikelfrequenz/GEYER-KX-327L.pdf> KX-327S.pdf <http://www.geyer-electronic.de/uploads/tx_userartikelfrequenz/GEYER-KX-327S.pdf> <http://www.geyer-electronic.de/fileadmin/template/img/logo-geyer-electronic.png> Details see: http://www.geyer-electronic.de/Frequenz-Produkte.9.0.html Created 2016-06-07, Hans Locher 2016 (C) Geyer Quartz Technology KX327VT,KX327FT,KX327RT,KX327NHT,KX327NHF,KX327S,KX327L;125105;1610;2012;3215;7015;8238;1,25x1,05,1.25x1.05;1,6x1,0,1.6x1.0;2,0x1,2,2.0x1.2;3,2x1,5,3.2x1.5;8,2x3,8,8.2x3.8,7.0x1.5,7,0x1,532.768kHz; LCSC_PART: C32346
Q2 = Transistor:NMOSFET_: N-Channel MOSFET - Popular parts; CATEGORY: Transistor; DESCRIPTION: MOSFET N-CH 100V 0.17A SOT-23; DRAIN_CURRENT: 170mA; LCSC_PART: C20917; MANUFACTURER: ON Semiconductor; MPN: BSS123L; OPERATING_TEMP: -55°C ~ 150°C; PART_STATUS: Active; ROHS_COMPLIANT: Yes; SUB-CATEGORY: MOSFET; THERMALLOSS: 360mW; TYPE: N-Channel
Q3 = Transistor:PMOSFET_: P-Channel MOSFET - Popular parts; CATEGORY: Transistor; DESCRIPTION: MOSFET P-CH 50V 130MA SOT-23; DRAIN_CURRENT: 130mA; LCSC_PARTS: C10487; MANUFACTURER: ON Semiconductor; MPN: BSS84; OPERATING_TEMP: -55°C ~ 150°C; PART_STATUS: Active; ROHS_COMPLIANT: Yes; SUB-CATEGORY: MOSFET; THERMALLOSS: 360mW; TYPE: P-Channel
R1-R13 R25-R27 R29-R33 R35-R37 = rcl:R-EU_: RESISTOR, European symbol; SPICEPREFIX: R
R14 = rcl:R-TRIMM: Trimm resistor; SPICEMODEL: X; SPICEPREFIXL: POT
RESET S2 = TS-1187A-B-A-B:TS-1187A-B-A-B: SPST 50mA @ 12VDC Top Actuated Round Button 160gf SMD Tactile Switches RoHS Check availability <https://pricing.snapeda.com/parts/TS-1187A-B-A-B/XKB%20Industrial%20Precision/view-part?ref=eda>; AVAILABILITY: Not in stock; DESCRIPTION: TS-1187A-B-A-B XKB Connectivity; LCSC_PART: C318884; MF: XKB Industrial Precision; MP: TS-1187A-B-A-B; PACKAGE: Package; PRICE: None
TP1 TP3-TP6 = testpad:TP: Test pad
U1 = STM32F103C8T6:STM32F103C8T6: Mainstream Performance line, ARM Cortex-M3 MCU with 64 Kbytes Flash, 72 MHz CPU, motor control, USB and CAN Check availability <https://pricing.snapeda.com/parts/STM32F103C8T6/STMicroelectronics/view-part?ref=eda>; AVAILABILITY: In Stock; CHECK_PRICES: https://www.snapeda.com/parts/STM32F103C8T6/STMicroelectronics/view-part/?ref=eda; DESCRIPTION: ARM® Cortex®-M3 STM32F1 Microcontroller IC 32-Bit 72MHz 64KB (64K x 8) FLASH 48-LQFP (7x7); LCSC_PART: C8734; MF: STMicroelectronics; MP: STM32F103C8T6; PACKAGE: LQFP-48 STMicroelectronics; PRICE: None; PURCHASE-URL: https://www.snapeda.com/api/url_track_click_mouser/?unipart_id=52195&manufacturer=STMicroelectronics&part_name=STM32F103C8T6&search_term=stm32f103c8t6; SNAPEDA_LINK: https://www.snapeda.com/parts/STM32F103C8T6/STMicroelectronics/view-part/?ref=snap
U2 = TPS613222ADBVR:TPS613222ADBVR: Check availability <https://pricing.snapeda.com/parts/TPS613222ADBVR/Texas%20Instruments/view-part?ref=eda>; AVAILABILITY: In Stock; CHECK_PRICES: https://www.snapeda.com/parts/TPS613222ADBVR/Texas+Instruments/view-part/?ref=eda; DESCRIPTION: 6-uA Quiescent Current, 1.8-A Switch Current Boost Converter; LCSC_PART: C2071163; MF: Texas Instruments; MP: TPS613222ADBVR; PACKAGE: SOT-23-5 Texas Instruments; PRICE: None; PURCHASE-URL: https://www.snapeda.com/api/url_track_click_mouser/?unipart_id=2771858&manufacturer=Texas Instruments&part_name=TPS613222ADBVR&search_term=tps613222a; SNAPEDA_LINK: https://www.snapeda.com/parts/TPS613222ADBVR/Texas+Instruments/view-part/?ref=snap
U3 = AMS1117-3.3:AMS1117-3.3: Check availability <https://pricing.snapeda.com/parts/AMS1117-3.3/Advanced%20Monolithic%20Systems/view-part?ref=eda>; AVAILABILITY: Not in stock; CHECK_PRICES: https://www.snapeda.com/parts/AMS1117-3.3/Advanced+Monolithic+Systems/view-part/?ref=eda; DESCRIPTION: Sot223/Pkg 1-Amp 3.3-Volt Low Drop Out Voltage Regulatator; LCSC_PART: C6186; MF: Advanced Monolithic Systems; MP: AMS1117-3.3; PACKAGE: SOT-223 Seeed Technology; PRICE: None; SNAPEDA_LINK: https://www.snapeda.com/parts/AMS1117-3.3/Advanced+Monolithic+Systems/view-part/?ref=snap
U4 = H-Brücke_BD622HFP-TR02:BD6222HFP-TR; COPYRIGHT: Copyright (C) 2022 Ultra Librarian. All rights reserved.; MANUFACTURER_PART_NUMBER: BD6222HFP-TR; MFR_NAME: ROHM Semiconductor
USB-B = Connector_USB:61729-1011: USB(2.0) Type-B, RCPT, 4POS, THT-R/A Datasheet <https://www.amphenol-icc.com/media/wysiwyg/files/drawing/61729.pdf>; CATEGORY: Connector; CONTACTS: 4; CURRENT_RATING: 1A; DESCRIPTION: CONN RCPT USB2.0 TYPEB 4POS R/A; GENDER: Receptacle; MANUFACTURER: Amphenol ICC (FCI); MOUNT_TYPE: R/A; MPN: 61729-1011BLF; OPERATING_TEMP: -55°C to 85°C; PART_STATUS: Active; ROHS_COMPLIANT: RoHS Compliant; SERIES: 61729; SUB-CATEGORY: USB; TYPE: USB-B
Y1 = 52101-101-REV-A_v16:CRYSTAL_NX5032GA: CRYSTAL; LCSC_PART: C115962

## Board
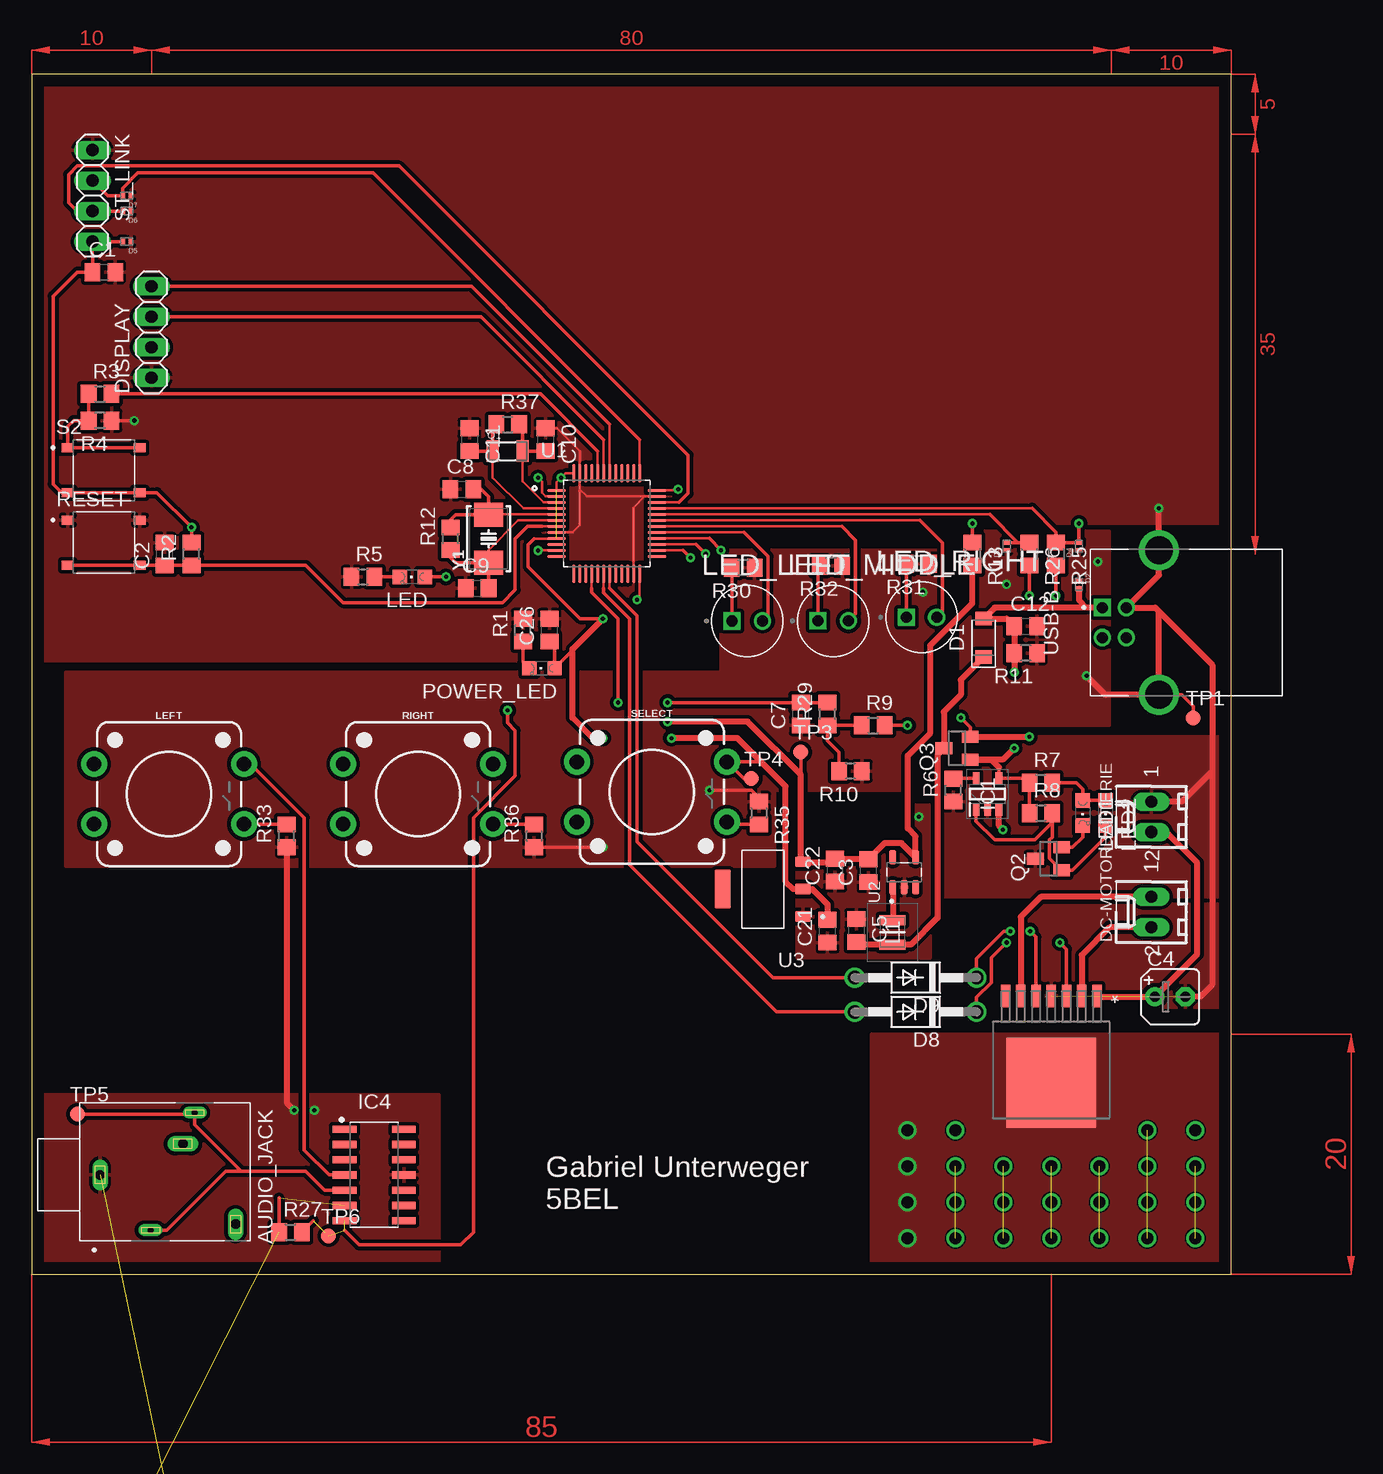
[diagram p4: board, top side]
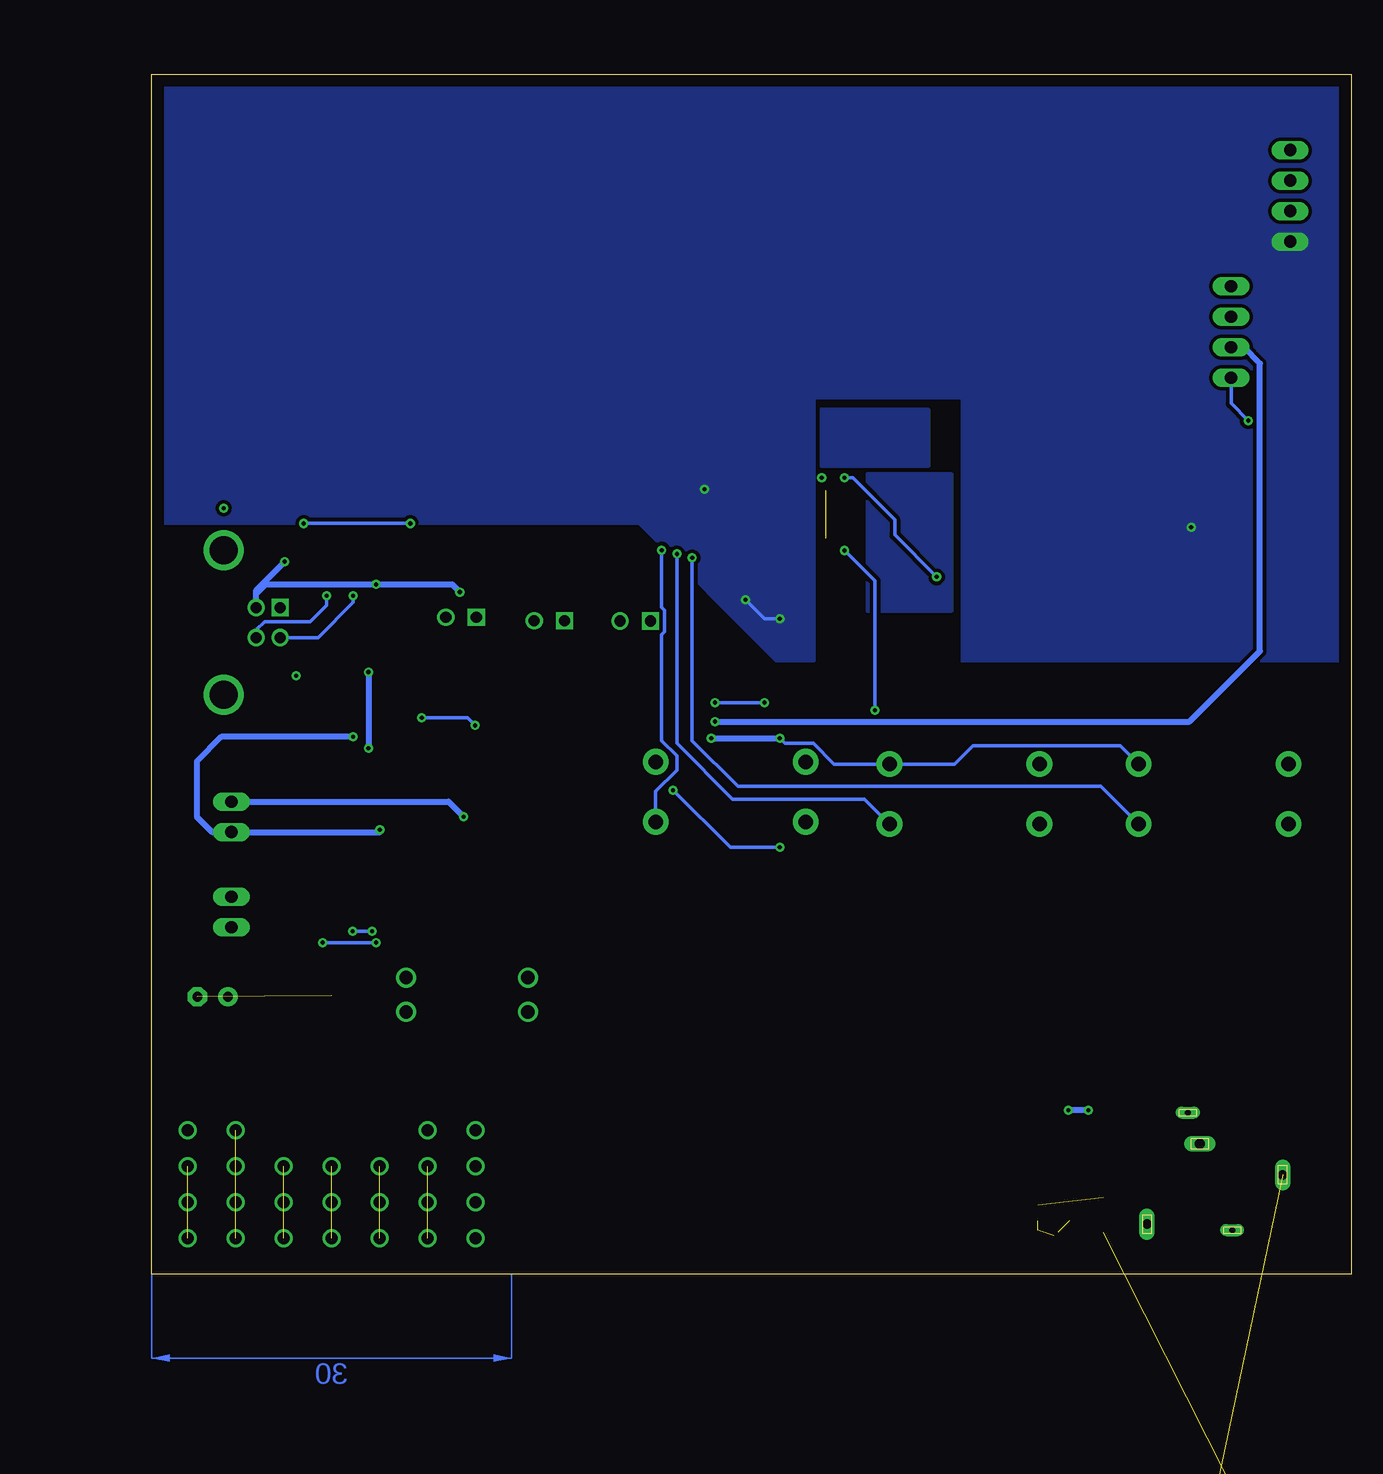
[diagram p5: board, bottom side, seen from below]

Size 100 x 100 mm. Coordinates in mm from the lower left corner, seen from the top.
Outline: 0,0 100,0 100,100 0,100 0,0
Copper layers (1*16): Top 0.035mm / dielectric 1.5mm / Bottom 0.035mm
Design rules "default *": minimum track width 6mil, minimum drill 0.35mm, track to track 5mil, track to pad 0.2mm, pad to pad 5mil, via to via 0.5mm, smd to smd 5mil, copper to edge 40mil, drill to drill 6mil, minimum pad ring 10mil, minimum via ring 8mil, stop-mask expansion 4mil, vias tented up to drill 0mil, thermal gap 10mil

### Footprints (pad centres in the part's own frame; a part is rotated, then mirrored left to right if it is on the bottom)
WENZHOU_PJ324M = drill 0.8 long: 1 0,5.4; 3 2.6,-1.5; 4 -4.1,-5.9 | drill 0.5 long: 2 5.2,-2.5; 5 -4.6,1.2
6410-02 = drill 1.016 long: 1 1.27,0; 2 -1.27,0
C0805 = smd 1.3 x 1.5: 1 -0.95,0; 2 0.95,0
B45181A = drill 0.813 pad 1.6: + -1.27,0 | drill 0.813 pad 1.6 octagon: - 1.27,0
SODFL3718X115 = smd 1.115 x 1.361: 1 -1.6,0; 2 1.6,0
DIO_TESD5V0L1UC_RJG = smd 0.41 x 0.56: 1 -0.35,0; 2 0.35,0
DO41-10 = drill 1.118: A 5.08,0; C -5.08,0
1X04 = drill 1.016 long: 1 -3.81,0; 2 -1.27,0; 3 1.27,0; 4 3.81,0
SOT95P280X100-5N = smd 1.05 x 0.55: 1 -1.3,0.95; 2 -1.3,0; 3 -1.3,-0.95; 4 1.3,-0.95; 5 1.3,0.95
SOIC127P600X175-14N = smd 1.968 x 0.599: 1 -2.473,3.81; 2 -2.473,2.54; 3 -2.473,1.27; 4 -2.473,0; 5 -2.473,-1.27; 6 -2.473,-2.54; 7 -2.473,-3.81; 8 2.473,-3.81; 9 2.473,-2.54; 10 2.473,-1.27; 11 2.473,0; 12 2.473,1.27; 13 2.473,2.54; 14 2.473,3.81
DFE2HCAH1R0MJ0L = smd 0.85 x 2.2: 1 -1.025,0; 2 1.025,0
CHIPLED_0805 = smd 1.2 x 1.2: A 0,-1.05; C 0,1.05
LEDRD254W50D500H1060 = drill 0.93 pad 1.4: A 1.27,0 | drill 0.93 pad 1.4 square: C -1.27,0
TACTILE_SWITCH_PTH_12MM = drill 1.2 pad 2.159: 1 6.25,-2.5; 2 -6.25,-2.5; 3 6.25,2.5; 4 -6.25,2.5
3.2X1.5 = smd 1 x 1.8: 1 -1.25,0; 2 1.25,0
SOT23 = smd 1 x 1.4: 1 -0.95,-1.1; 2 0.95,-1.1; 3 0,1.1
R0805 = smd 1.3 x 1.5: 1 -0.95,0; 2 0.95,0
RTRIM43P = drill 0.9: 1 -7.62,1.27; 2 0,-1.27; 3 5.08,1.27
SW_TS-1187A-B-A-B = smd 1 x 0.75: A -3,1.875; B 3,1.875; C -3,-1.875; D 3,-1.875
B1,27 = smd 1.27 x 1.27: TP 0,0
QFP50P900X900X160-48N = smd 1.56 x 0.28: 1 -4.18,2.75; 2 -4.18,2.25; 3 -4.18,1.75; 4 -4.18,1.25; 5 -4.18,0.75; 6 -4.18,0.25; 7 -4.18,-0.25; 8 -4.18,-0.75; 9 -4.18,-1.25; 10 -4.18,-1.75; 11 -4.18,-2.25; 12 -4.18,-2.75; 25 4.18,-2.75; 26 4.18,-2.25; 27 4.18,-1.75; 28 4.18,-1.25; 29 4.18,-0.75; 30 4.18,-0.25; 31 4.18,0.25; 32 4.18,0.75; 33 4.18,1.25; 34 4.18,1.75; 35 4.18,2.25; 36 4.18,2.75 | smd 0.28 x 1.56: 13 -2.75,-4.18; 14 -2.25,-4.18; 15 -1.75,-4.18; 16 -1.25,-4.18; 17 -0.75,-4.18; 18 -0.25,-4.18; 19 0.25,-4.18; 20 0.75,-4.18; 21 1.25,-4.18; 22 1.75,-4.18; 23 2.25,-4.18; 24 2.75,-4.18; 37 2.75,4.18; 38 2.25,4.18; 39 1.75,4.18; 40 1.25,4.18; 41 0.75,4.18; 42 0.25,4.18; 43 -0.25,4.18; 44 -0.75,4.18; 45 -1.25,4.18; 46 -1.75,4.18; 47 -2.25,4.18; 48 -2.75,4.18
SOT95P280X145-5N = smd 1.21 x 0.59: 1 -1.255,0.95; 2 -1.255,0; 3 -1.255,-0.95; 4 1.255,-0.95; 5 1.255,0.95
SOT229P700X180-4N = smd 1.31 x 0.93: 1 -3.345,2.29; 2 -3.345,0; 3 -3.345,-2.29 | smd 1.31 x 3.24: 4 3.345,0
HRP7_ROM-M = smd 0.787 x 1.854: 1 -3.81,-6.172; 2 -2.54,-6.172; 3 -1.27,-6.172; 4 0,-6.172; 5 1.27,-6.172; 6 2.54,-6.172; 7 3.81,-6.172 | smd 7.48 x 7.49: 8 0,1.051
61729-1011BLF = drill 0.92 square: 1 1.25,4.71 | drill 0.92: 2 -1.25,4.71; 3 -1.25,2.71; 4 1.25,2.71 | drill 2.3: SH1 -6.02,0; SH2 6.02,0
CRYSTAL_2-SMD-5X3 = smd 2 x 2.4: 1 -2,0; 2 2,0

### Placement (x,y rotation side)
AUDIO_JACK  11.11,8.26 90 top
BATTERIE  93.34,38.1 90 top
C1  6.03,83.5 0 top
C2  11.11,60.01 90 top
C3  69.77,33.61 90 top
C4  94.91,23.11 0 top
C5  68.75,28.64 270 top
C7  64.14,46.67 90 top
C8  35.88,65.41 0 top
C9  37.15,57.15 0 top
C10  42.86,69.53 270 top
C11  36.51,69.53 270 top
C12  82.87,53.98 0 top
C21  66.36,28.57 90 top
C22  66.99,33.66 90 top
C26  43.18,53.66 90 top
D1  79.38,53.02 90 top
D2  87.31,57.47 270 top
D3  81.28,60.64 90 top
D4  87.31,60.64 90 top
D5  7.94,86.04 180 top
D6  7.94,88.58 180 top
D7  7.94,89.85 180 top
D8  73.7,21.84 180 top
D9  73.7,24.7 180 top
DC-MOTOR  93.34,30.16 90 top
DISPLAY  10,78.5 90 top
IC1  79.69,40.01 90 top
IC4  28.57,8.26 0 top
L1  71.76,28.47 90 top
LED  31.75,58.1 90 top
LED1  87.63,38.42 180 top
LED2  89.53,38.42 180 top
LED_LEFT  59.66,54.42 0 top
LED_MIDDLE  66.83,54.43 0 top
LED_RIGHT  74.19,54.74 0 top
LEFT  11.46,40 0 top
POWER_LED  42.55,50.48 90 top
Q1  39.69,68.58 0 top
Q2  84.77,34.61 90 top
Q3  77.15,43.81 90 top
R1  40.96,53.66 90 top
R2  13.34,60.01 90 top
R3  5.71,73.34 0 top
R4  5.71,71.12 180 top
R5  27.62,58.1 0 top
R6  76.83,40.32 90 top
R7  84.14,40.96 0 top
R8  84.14,38.42 0 top
R9  70.17,45.72 0 top
R10  68.26,41.91 180 top
R11  82.87,51.75 180 top
R12  34.92,61.28 90 top
R13  78.42,60.01 270 top
R14  12.7,-26.04 180 bottom  (outside the outline)
R25  85.41,60.01 270 top
R26  83.19,60.01 270 top
R27  21.59,3.49 0 top
R29  66.36,46.67 90 top
R30  59.33,58.86 180 top
R31  73.86,59.18 180 top
R32  66.64,59.04 180 top
R33  21.27,36.51 90 top
R35  60.64,38.42 270 top
R36  41.91,36.51 90 top
R37  39.69,70.8 0 top
RESET  6.03,60.96 0 top
RIGHT  32.22,40 0 top
S2  6.03,66.99 0 top
SELECT  51.72,40.18 0 top
ST_LINK  5.08,89.85 270 top
TP1  96.84,46.35 0 top
TP3  64.14,43.5 0 top
TP4  60.01,41.27 0 top
TP5  3.81,13.34 0 top
TP6  24.77,3.17 0 top
U1  47.94,62.55 0 top
U2  72.75,33.49 90 top
U3  60.96,32.07 180 top
U4  85,17 180 top
USB-B  93.98,54.29 90 top
Y1  38.1,61.28 90 top

### Tracks (layer width: path | path; a pad name or v marks a point on that pad's centre or on a via)
+3V3  (via drill 0.35)  (1 unrouted)
  Top 0.203: v50.48,56.2 50.69,56.41 U1.24 | U1.9 43.74,61.28 41.91,61.28 | U1.1 43.76,65.99 v44.13,66.36 44.5,66.73 U1.48 | v53.9,65.41 53.79,65.3 U1.36
  Top 0.305: D5.2 ST_LINK.4 C1.1 3.81,83.5 1.8,81.49 1.8,65.82 2.51,65.12 S2.C S2.D 10.45,65.12 v13.34,62.23 R2.2 | 41.91,61.28 41.39,60.76 41.39,58.94 45.72,54.61 v47.62,54.61 | 61.28,42.23 60.83,42.68 SELECT.3 59.37,41.27 TP4.TP | C26.1 43.59,52.29 POWER_LED.A 45.08,51.97 45.08,52.07 | LEFT.3 18.28,42.5 22.74,38.04 22.74,10.32 24.81,8.26 IC4.4
  Top 0.508: C21.2 66.36,30.8 65.09,32.07 U3.2 63.5,32.07 62.87,32.7 62.87,40.64 61.28,42.23 58.85,44.66 v53.34,44.66 | v47.62,44.66 46.78,44.66 45.08,46.36 45.08,52.07 v47.62,54.61
  Bottom 0.305: v47.62,54.61 48.9,54.61 v50.48,56.2 | v47.62,44.66 47.18,44.22 44.83,44.22 43.11,42.5 RIGHT.3 33.06,42.5 31.53,44.04 19.25,44.04 LEFT.3
  Bottom 0.508: v53.34,44.66 v47.62,44.66
  pour Bottom (isolate 0.305, no thermals): 0,100.01 0,51.12 32.38,51.12 32.38,58.1 32.38,73.03 35.56,73.03 44.77,73.03 44.77,51.12 47.94,51.12 59.37,62.55 100.01,62.55 100.01,100.01
+5V  (via drill 0.35)
  Top 0.305: TP3.TP 64.14,41.59
  Top 0.508: v53.02,46.04 59.69,46.04 64.14,41.59 64.14,34.53 U3.3 64.38,34.29 66.67,34.29 C22.2 67.03,34.56 C3.2 71.12,35.91 72.53,35.91 U2.4 73.7,36.48 73.04,37.13 73.04,43.2 74.93,45.09 74.93,52.39 78.42,55.88 R13.2
  Bottom 0.508: v53.02,46.04 13.48,46.04 7.6,51.92 7.6,75.87 8.96,77.23 DISPLAY.2
BATTERY_LEVEL  (via drill 0.35)
  Top 0.203: U1.16 46.69,57.15
  Top 0.305: 46.69,57.15 46.69,56.81 48.9,54.61 v48.9,47.62 | v53.02,47.62 C7.2 R29.2
  Bottom 0.305: v48.9,47.62 v53.02,47.62
BOOT0
  Top 0.203: U1.44 47.19,68.58
  Top 0.305: 47.19,68.58 42.43,73.34 R3.2
BUTTON_1  (via drill 0.35)
  Top 0.203: U1.26 53.34,60.3 54.32,60.3
  Top 0.305: R33.2 17.75,37.46 LEFT.1 | 54.32,60.3 v54.93,59.69
  Bottom 0.305: v54.93,59.69 54.93,44.45 51.11,40.64 20.85,40.64 LEFT.1
BUTTON_2  (via drill 0.35)
  Top 0.203: U1.27 53.34,60.8 55.41,60.8
  Top 0.305: RIGHT.1 41.87,37.5 R36.2 | 55.41,60.8 v56.2,60.01
  Bottom 0.305: v56.2,60.01 56.2,44.23 51.55,39.58 40.55,39.58 RIGHT.1
BUTTON_3  (via drill 0.35)
  Top 0.203: U1.28 53.34,61.3 56.49,61.3
  Top 0.305: v57.47,60.33 56.49,61.3 | R35.2 58.18,37.47 SELECT.1
  Bottom 0.305: SELECT.1 57.97,40.22 56.2,41.99 56.2,43.18 57.47,44.45 57.47,53.26 57.22,53.51 57.22,55.33 57.47,55.58 v57.47,60.33
DISPLAY_SCL
  Top 0.203: U1.42 48.19,70.8
  Top 0.305: 48.19,70.8 36.69,82.31 DISPLAY.4
DISPLAY_SDA
  Top 0.203: U1.43 47.69,69.53
  Top 0.305: 47.69,69.53 37.45,79.77 DISPLAY.3
GND  (via drill 0.35)  (3 unrouted)
  Top 0.203: U1.8 45.09,61.8 45.69,62.41 45.69,65.41 | 45.69,65.41 U1.47 45.72,68.58 43.82,70.48 C10.1 | U1.35 51.12,64.8 | 51.12,64.8 46.3,64.8 45.69,65.41 | U1.23 50.19,63.87 51.12,64.8
  Top 0.305: R36.1 v47.62,35.56 | v56.52,40.32 60.01,40.32 60.64,39.69 R35.1 | USB-B.SH1 95.87,48.27 96.84,47.31 TP1.TP | v8.57,71.12 R4.1
  Top 0.508: 93.98,55.23 93.66,55.54 USB-B.4 93.98,58.25 USB-B.SH2 v93.98,63.82 | 93.98,55.23 98.42,50.78 98.42,41.91 | 98.42,41.91 95.89,39.37 BATTERIE.1 | 98.42,41.91 98.42,24.09 97.44,23.11 C4.- | R33.1 21.27,14.29 v21.91,13.65 | 93.98,55.23 USB-B.SH1 89.52,48.27 v87.95,49.85
  Bottom 0.305: v47.62,35.56 51.75,35.56 v56.52,40.32 | DISPLAY.1 10,72.55 v8.57,71.12
  Bottom 0.508: BATTERIE.1 75.25,39.37 v73.98,38.1 | v74.3,56.83 74.93,57.47 v81.28,57.47 90.49,57.47 91.27,56.69 USB-B.4 91.27,57 v88.9,59.37 | v21.91,13.65 v23.58,13.65
  pour Top (isolate 0.305): 99.38,22.23 75.56,22.23 75.56,30.8 99.38,30.8
  pour Top (isolate 0.305): 74.93,26.35 63.82,26.35 63.82,39.05 74.93,39.05
  pour Top (isolate 0.305): 99.38,31.43 75.56,31.43 75.56,44.77 99.38,44.77
  pour Top (isolate 0.305): 2.86,50.16 2.86,33.97 61.91,33.97 61.91,40.32 74.93,40.32 74.93,50.8 76.83,52.7 76.83,60.33 57.47,60.33 57.47,50.16
  pour Top (isolate 0.305): 77.47,61.91 77.47,45.72 89.85,45.72 89.85,61.91
  pour Top (isolate 0.305): 0,0 33.97,0 33.97,14.92 0,14.92
  pour Top (isolate 0.305): 0,100.01 100.01,100.01 100.01,62.55 59.37,62.55 47.94,51.12 0,51.12
  pour Bottom (isolate 0.305, no thermals): 35.24,72.07 35.24,67.31 44.13,67.31 44.13,72.07
  pour Bottom (isolate 0.305, no thermals): 33.66,66.67 40.32,66.67 40.32,55.24 33.34,55.24 33.34,66.67
LED_LEFT
  Top 0.203: U1.29 53.34,61.8 59.4,61.8
  Top 0.305: LED_LEFT.A 61.39,54.88 61.39,59.8 59.4,61.8
LED_MIDDLE
  Top 0.203: 67.56,62.3 53.34,62.3 U1.30
  Top 0.305: LED_MIDDLE.A 68.69,55.03 68.69,61.16 67.56,62.3
LED_RIGHT
  Top 0.203: U1.31 53.34,62.8 74.05,62.8
  Top 0.305: 74.05,62.8 75.92,60.92 75.92,55.19 LED_RIGHT.A
MOTOR_PWM1
  Top 0.203: U1.18 47.69,57.15
  Top 0.305: D8.A 62.12,21.84 49.85,34.11 49.85,54.61 47.69,56.77 47.69,57.15
MOTOR_PWM2
  Top 0.203: U1.19 48.19,57.15
  Top 0.305: 48.19,57.15 50.48,54.86 50.48,36.02 61.8,24.7 D9.A
MOTORA
  Top 0.508: DC-MOTOR.2 89.85,28.89 87.54,26.58 U4.2
MOTORB
  Top 0.508: DC-MOTOR.1 84.14,31.43 82.46,29.75 U4.6
N$1
  Top 0.508: L1.2 71.8,29.53 U2.1
N$2
  Top 0.305: R5.2 LED.C
N$3
  Top 0.305: R1.1 40.96,51.02 POWER_LED.C
N$4
  Top 0.305: R10.2 67.31,43.5 66.36,44.45 R29.1 R9.1
N$5
  Top 0.305: R3.1 R4.2 3.5,71.12 3.03,70.66 S2.A S2.B
N$6  (via drill 0.35)
  Top 0.305: D8.C 78.78,23.05 80.01,24.28 80.01,26.35 v81.28,27.62 | U4.3 86.27,27.08 v85.72,27.62
  Bottom 0.305: v85.72,27.62 v81.28,27.62
N$8
  Top 0.305: R6.2 76.87,41.3 IC1.5
N$9
  Top 0.305: LED2.C 89.53,36.41 86.78,33.66 Q2.1 84.87,34.66 84.87,36.18 85.09,36.4 R8.2 85.09,37.64 83.65,36.2 80.3,36.2 78.74,37.75 IC1.1
N$11
  Top 0.305: LED2.A LED1.A 87.63,40.42 87.09,40.96 R7.2
N$12
  Top 0.305: LED1.C 87.63,36.41 86.77,35.56 Q2.2
N$14  (via drill 0.35)
  Top 0.305: D9.C 78.78,26.29 81.06,28.57 v81.6,28.57 | v83.25,28.57 83.73,28.09 U4.5
  Bottom 0.305: v83.25,28.57 v81.6,28.57
N$16  (2 unrouted)
  Top 0.305: 20.64,6.35 R27.1
N$19
  Top 0.305: LED_LEFT.C 58.4,58.88 R30.2
N$20
  Top 0.305: LED_RIGHT.C 72.92,59.17 R31.2
N$23
  Top 0.305: LED_MIDDLE.C 65.56,58.91 R32.2
N$29  (via drill 0.35)
  Top 0.305: v85.41,56.52 R25.2
  Bottom 0.305: USB-B.3 91.27,53.68 90.58,54.37 86.78,54.37 85.41,55.74 v85.41,56.52
N$30  (via drill 0.35)
  Top 0.305: R26.2 v83.19,56.52
  Bottom 0.305: USB-B.2 86.11,53.04 83.19,55.97 v83.19,56.52
OSC32IN
  Top 0.203: U1.3 42.7,64.3 40.94,66.06 Q1.2
  Top 0.305: C10.2 Q1.2 40.94,70.5 R37.2
OSC32OUT
  Top 0.203: U1.4 41,63.8 38.44,66.36 Q1.1
  Top 0.305: C11.2 Q1.1 | Q1.1 | R37.1 38.44,70.5 Q1.1
OSCIN
  Top 0.203: U1.5 38.12,63.3 Y1.2
  Top 0.305: R12.2 34.92,62.86 35.34,63.28 Y1.2 38.1,64.77 37.47,65.41 C8.2
OSCOUT
  Top 0.203: Y1.1 38.1,60.33 40.57,62.8 U1.6
  Top 0.305: R12.1 34.92,59.69 35.34,59.28 Y1.1 C9.2
PAD  (via drill 1)
  other vias: 73,12 73,9 73,6 73,3
  pour Top (no thermals): 100,0 70,0 70,20 100,20
PAD1  (via drill 1)  (2 unrouted)
  other vias: 77,9 77,6 77,3
PAD2  (via drill 1)
  other vias: 77,12
PAD3  (via drill 1)  (2 unrouted)
  other vias: 81,9 81,6 81,3
PAD4  (via drill 1)  (2 unrouted)
  other vias: 85,9 85,6 85,3
PAD5  (via drill 1)  (2 unrouted)
  other vias: 89,9 89,6 89,3
PAD6  (via drill 1)  (3 unrouted)
  other vias: 93,12 93,9 93,6 93,3
PAD7  (via drill 1)  (2 unrouted)
  other vias: 97,9 97,6 97,3
PAD8  (via drill 1)
  other vias: 97,12
PC13  (via drill 0.35)
  Top 0.203: U1.2 42.84,64.8 42.55,65.09 42.55,66.04 v42.23,66.36
  Top 0.305: LED.A v34.55,58.1
  Bottom 0.305: v34.55,58.1 38.04,61.59 38.04,62.87 41.53,66.36 v42.23,66.36
RESET
  Top 0.203: 42.55,62.3 U1.7
  Top 0.305: 42.55,62.3 41.34,62.3 40.32,61.28 40.32,57.01 39.25,55.94 25.97,55.94 22.86,59.06 R2.1 C2.1 9.06,59.06 RESET.D RESET.C
SIGNAL_IN
  Top 0.305: AUDIO_JACK.5 11.28,3.65 16.19,8.57 17.46,8.57 | IC4.5 24.45,6.99 22.86,8.57 17.46,8.57 | 17.46,8.57 13.61,12.42 AUDIO_JACK.2 13.49,13.34 TP5.TP
SIGNAL_OPAMP  (via drill 0.35)  (3 unrouted)
  Top 0.203: U1.11 42.55,60.3
  Top 0.305: 42.55,60.3 v42.23,60.3 | v39.69,46.97 39.69,45.92 40.32,45.28 40.32,41.52 36.83,38.03 36.83,3.49 35.78,2.44 27.3,2.44 26.14,3.6 26.1,3.64 | 24.45,3.49 TP6.TP | R27.2 23.49,4.45
  Bottom 0.305: v42.23,60.3 39.69,57.76 v39.69,46.97
SWDCLK
  Top 0.203: 50.69,69.53 U1.37
  Top 0.305: ST_LINK.2 6.35,89.85 D7.2 7.59,90.49 8.86,91.76 28.47,91.76 50.69,69.53
SWDIO
  Top 0.203: U1.34 53.98,64.3
  Top 0.305: D6.2 ST_LINK.3 3.81,88.58 3.1,89.29 3.1,91.63 3.81,92.34 30.65,92.34 54.74,68.25 54.74,65.06 53.98,64.3
USB+  (via drill 0.35)
  Top 0.203: U1.33 52.12,63.82 83.41,63.82
  Top 0.305: 83.41,63.82 85.41,61.82 R25.1 87.28,60.96 D4.2 v87.31,62.55 | R13.1 v78.42,62.55
  Bottom 0.305: v78.42,62.55 v87.31,62.55
USB-
  Top 0.203: U1.32 53.34,63.3 79.89,63.3
  Top 0.305: D3.2 81.31,60.96 R26.1 82.23,60.96 79.89,63.3
VBAT  (via drill 0.35)
  Top 0.305: R9.2 v73.03,45.72 | Q3.2 78.25,45.57 v77.47,46.35
  Top 0.508: U4.1 88.87,23.11 C4.+ 97.18,26.66 97.18,34.27 94.61,36.83 BATTERIE.2 93.25,36.83 | v80.96,37.03 80.64,37.35 IC1.3 | Q3.2 v83.18,44.77 v83.19,44.77
  Bottom 0.305: v73.03,45.72 73.66,46.35 v77.47,46.35
  Bottom 0.508: v80.96,37.03 80.96,36.83 BATTERIE.2 94.93,36.83 96.23,38.12 96.23,42.71 94.17,44.77 v83.19,44.77
VBUS  (via drill 0.35)
  Top 0.305: R8.1 R7.1 82.84,41.3 IC1.4 | IC1.4 80.64,42.23
  Top 0.508: 80.64,42.23 80.01,42.87 Q3.1 80.97,42.87 v81.92,43.81 | IC1.4 | v81.92,50.16 R11.2 C12.1 81.27,54.62 D1.2 80.3,55.54 87.95,55.54 | USB-B.1 87.95,55.54 | D2.2 87.31,56.18 87.95,55.54
  Bottom 0.508: v81.92,50.16 v81.92,43.81
VIN
  Top 0.508: D1.1 77.47,49.52 77.47,48.26 76.05,46.84 Q3.3 75.53,43.29 75.53,29.67 73.3,27.45 L1.1 68.99,27.45 C5.2
(copper drawn outside any net)
  shapes: Bottom area x1, Top area x7

### Text on the board
tNames: Gabriel Unterweger / 5BEL
tDocu: BATTERY | MOTOR